# Altium schematic sheet sheets_entries.SchDoc
size A
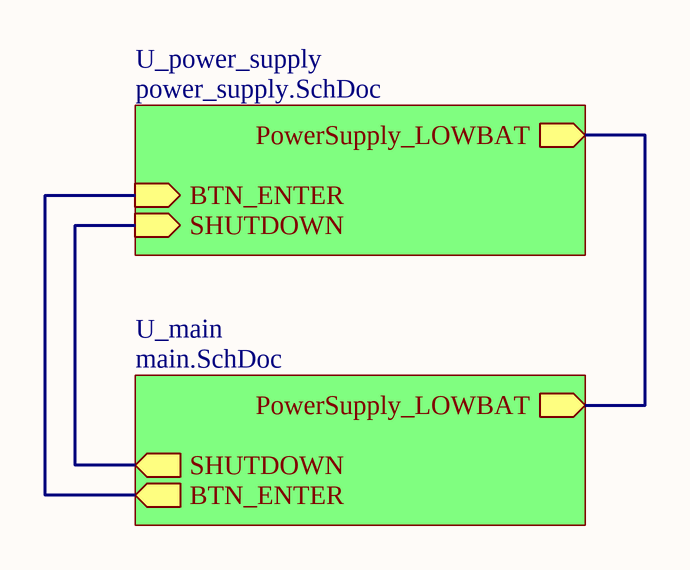
[diagram p0: sheets_entries.SchDoc]

## Sub-sheets
U_main = main.SchDoc: PowerSupply_LOWBAT (out), SHUTDOWN (out), BTN_ENTER (out)
U_power_supply = power_supply.SchDoc: SHUTDOWN (in), BTN_ENTER (in), PowerSupply_LOWBAT (out)

## Nets
(unnamed): sheet U_power_supply/SHUTDOWN, sheet U_main/SHUTDOWN
(unnamed): sheet U_power_supply/BTN_ENTER, sheet U_main/BTN_ENTER
(unnamed): sheet U_power_supply/PowerSupply_LOWBAT, sheet U_main/PowerSupply_LOWBAT